# EAGLE design cdcio2 (EAGLE 6.6.0)
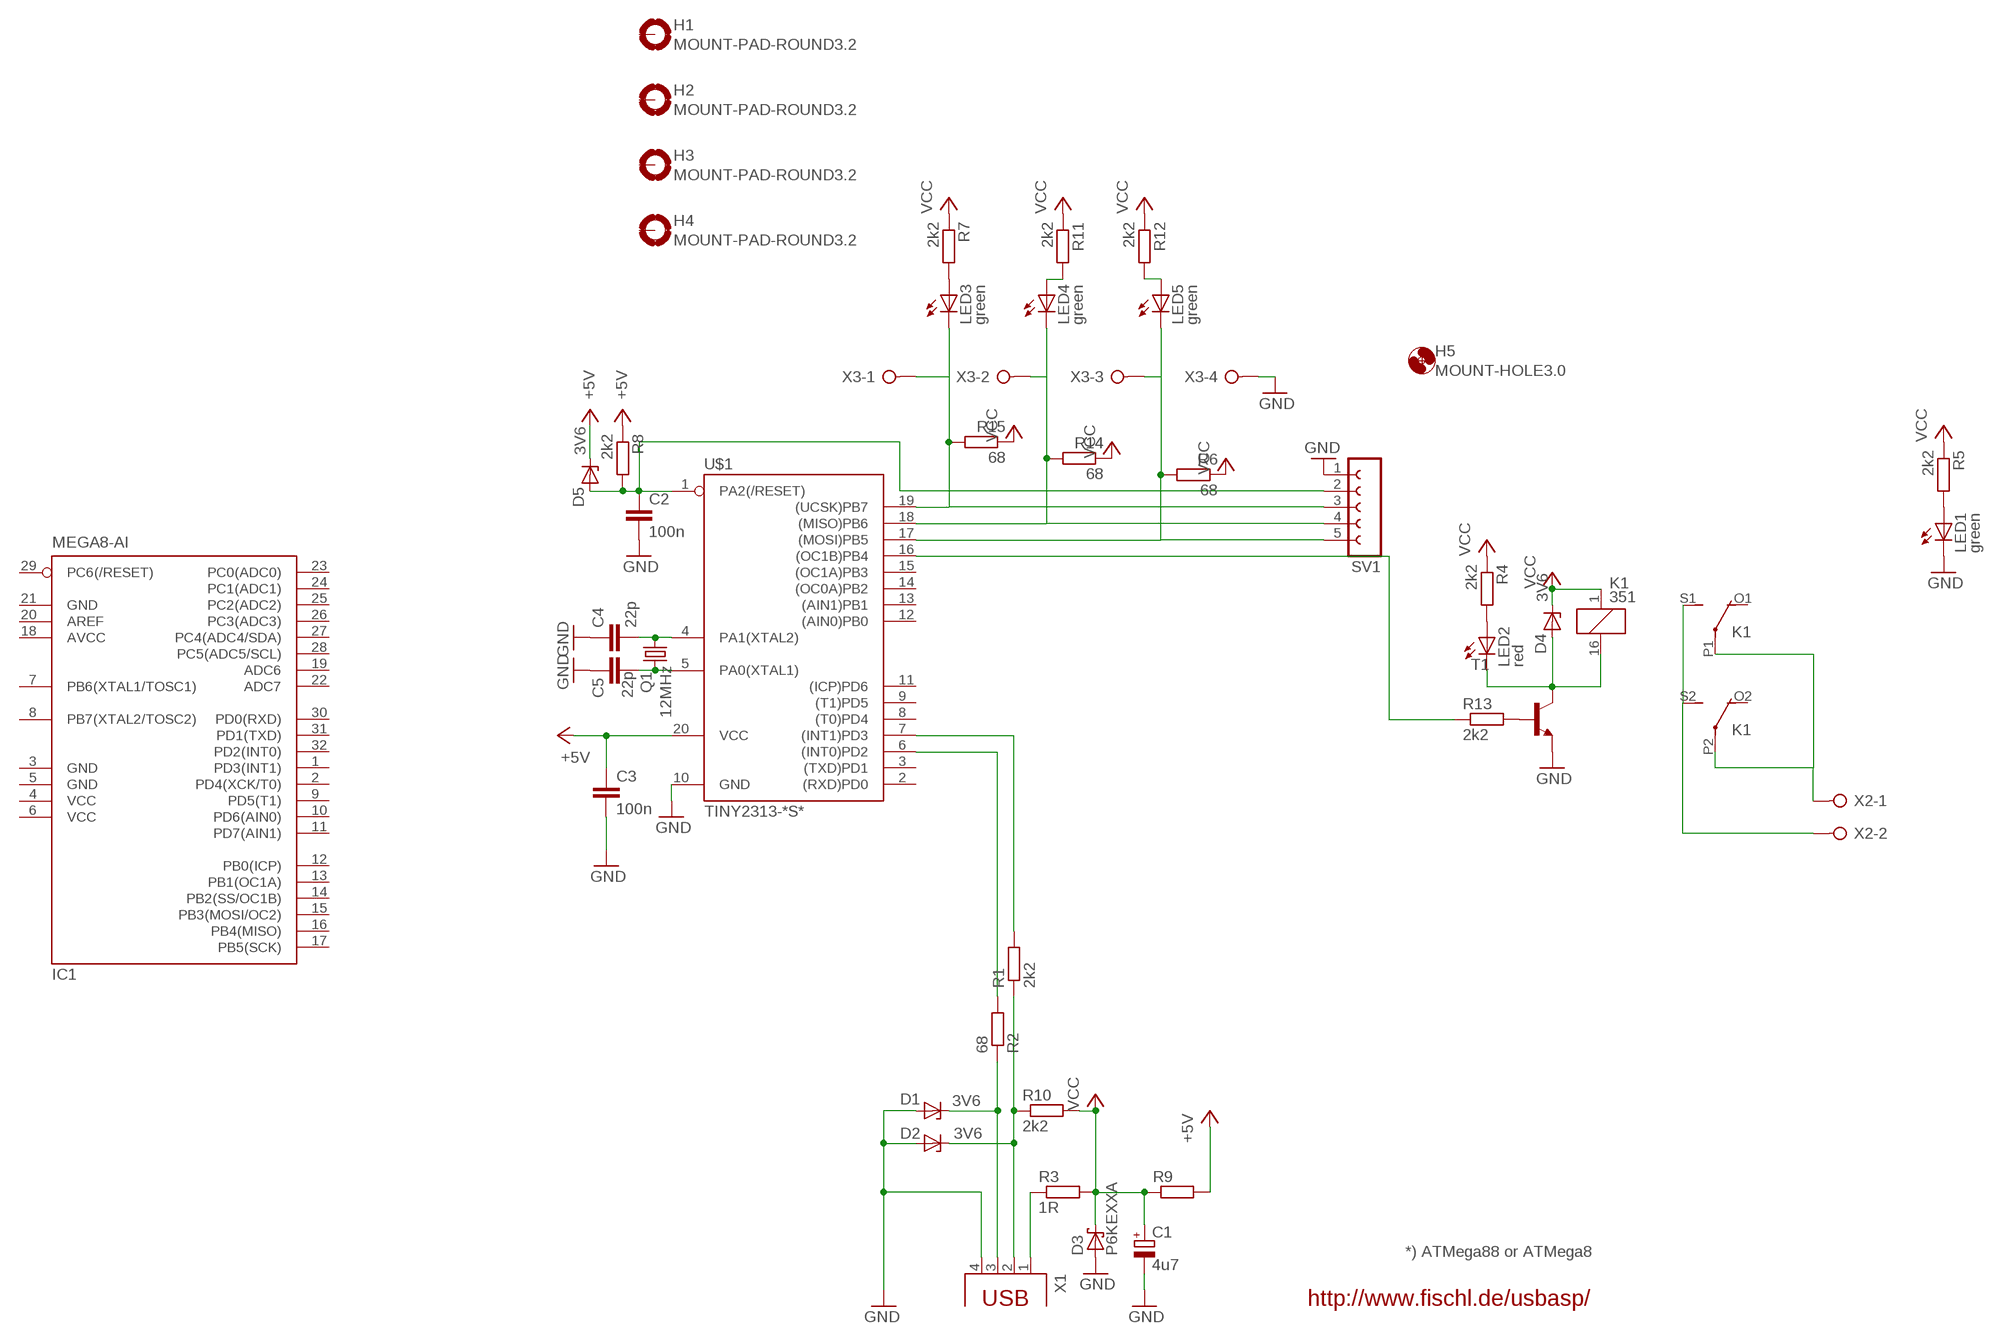
[diagram p0: schematic, sheet 1]

## Parts
C1  4u7  CPOL-EUE2.5-5  [E2,5-5]
C2  100n  C-EU025-024X044  [C025-024X044]
C3  100n  C-EU025-024X044  [C025-024X044]
C4  22p  C-EU025-024X044  [C025-024X044]
C5  22p  C-EU025-024X044  [C025-024X044]
D1  3V6  ZENER-DIODEDO34-7  [DO34Z7]
D2  3V6  ZENER-DIODEDO34-7  [DO34Z7]
D3  P6KEXXA  [C1702-15]
D4  3V6  ZENER-DIODEDO34-7  [DO34Z7]
D5  3V6  ZENER-DIODEDO34-7  [DO34Z7]
H1  MOUNT-PAD-ROUND3.2  [3,2-PAD]
H2  MOUNT-PAD-ROUND3.2  [3,2-PAD]
H3  MOUNT-PAD-ROUND3.2  [3,2-PAD]
H4  MOUNT-PAD-ROUND3.2  [3,2-PAD]
H5  MOUNT-HOLE3.0  [3,0]
IC1  MEGA8-AI  [TQFP32-08]
K1  351  [351]
LED1  green  LED3MM  [LED3MM]
LED2  red  LED3MM  [LED3MM]
LED3  green  LED3MM  [LED3MM]
LED4  green  LED3MM  [LED3MM]
LED5  green  LED3MM  [LED3MM]
Q1  12MHz  CRYTALHC49S  [HC49/S]
R1  2k2  R-EU_0207/2V  [0207/2V]
R2  68  R-EU_0207/10  [0207/10]
R3  1R  R-EU_0207/2V  [0207/2V]
R4  2k2  R-EU_0207/2V  [0207/2V]
R5  2k2  R-EU_0207/2V  [0207/2V]
R6  68  R-EU_0207/10  [0207/10]
R7  2k2  R-EU_0207/2V  [0207/2V]
R8  2k2  R-EU_0207/2V  [0207/2V]
R9  R-EU_0207/2V  [0207/2V]
R10  2k2  R-EU_0207/2V  [0207/2V]
R11  2k2  R-EU_0207/2V  [0207/2V]
R12  2k2  R-EU_0207/2V  [0207/2V]
R13  2k2  R-EU_0207/2V  [0207/2V]
R14  68  R-EU_0207/10  [0207/10]
R15  68  R-EU_0207/10  [0207/10]
SV1  FE05-1  [FE05-1]
T1  2N4124-NPN-TO92-CBE  [TO92-CBE]
U$1  TINY2313-*S*  [SO20L$]
X1  PN61729  [PN61729]
X2  W237-02P  [W237-132]
X3  W237-04P  [W237-4P]

## Nets
+5V: C3.1 D5.C R8.1 R9.2 U$1.20(VCC)
GND: C1.- C2.2 C3.2 C4.1 C5.1 D1.A D2.A D3.A LED1.K(C) SV1.1 T1.E U$1.10(GND) X1.4 X3.4
N$1: C2.1 D5.A R8.2 SV1.2 U$1.1(PA2(/RESET))
N$2: R13.2 T1.B
N$3: R13.1 U$1.16((OC1B)PB4)
N$4: D4.A K1.16 LED2.K(C) T1.C
N$5: D2.C R1.1 R10.1 X1.2
N$6: K1.S1(2:S) K1.S2(3:S) X2.2
N$7: R2.2 U$1.6((INT0)PD2)
N$8: D1.C R2.1 X1.3
N$9: LED2.A R4.2
N$10: K1.P1(2:P) K1.P2(3:P) X2.1
N$11: R3.1 X1.1
N$12: LED1.A R5.2
N$13: LED3.A R7.2
N$14: LED4.A R11.2
N$15: LED5.A R12.2
N$16: R1.2 U$1.7((INT1)PD3)
N$17: LED3.K(C) R15.2 SV1.3 U$1.19((UCSK)PB7) X3.1
N$18: LED4.K(C) R14.2 SV1.4 U$1.18((MISO)PB6) X3.2
N$19: LED5.K(C) R6.2 SV1.5 U$1.17((MOSI)PB5) X3.3
N$22: C4.2 Q1.2 U$1.4(PA1(XTAL2))
N$23: C5.2 Q1.1 U$1.5(PA0(XTAL1))
VCC: C1.+ D3.C D4.C K1.1 R3.2 R4.1 R5.1 R6.1 R7.1 R9.1 R10.2 R11.1 R12.1 R14.1 R15.1
Unconnected: H1.B3,2(MOUNT) H2.B3,2(MOUNT) H3.B3,2(MOUNT) H4.B3,2(MOUNT) IC1.1(PD3(INT1)) IC1.2(PD4(XCK/T0)) IC1.7(PB6(XTAL1/TOSC1)) IC1.8(PB7(XTAL2/TOSC2)) IC1.9(PD5(T1)) IC1.10(PD6(AIN0)) IC1.11(PD7(AIN1)) IC1.12(PB0(ICP)) IC1.13(PB1(OC1A)) IC1.14(PB2(SS/OC1B)) IC1.15(PB3(MOSI/OC2)) IC1.16(PB4(MISO)) IC1.17(PB5(SCK)) IC1.19(ADC6) IC1.20(AREF) IC1.22(ADC7) IC1.23(PC0(ADC0)) IC1.24(PC1(ADC1)) IC1.25(PC2(ADC2)) IC1.26(PC3(ADC3)) IC1.27(PC4(ADC4/SDA)) IC1.28(PC5(ADC5/SCL)) IC1.29(PC6(/RESET)) IC1.30(PD0(RXD)) IC1.31(PD1(TXD)) IC1.32(PD2(INT0)) K1.O1(2:O) K1.O2(3:O) U$1.2((RXD)PD0) U$1.3((TXD)PD1) U$1.8((T0)PD4) U$1.9((T1)PD5) U$1.11((ICP)PD6) U$1.12((AIN0)PB0) U$1.13((AIN1)PB1) U$1.14((OC0A)PB2) U$1.15((OC1A)PB3)

## Notes on the sheet
- *) ATMega88 or ATMega8
- http://www.fischl.de/usbasp/

## Power pins joined to a net without a drawn wire
AVCC: IC1.18(AVCC)
GND: IC1.3(GND) IC1.5(GND) IC1.21(GND)
VCC: IC1.4(VCC) IC1.6(VCC)

## Library data of the parts
C1 = rcl:CPOL-EU: POLARIZED CAPACITOR, European symbol
C2-C5 = rcl:C-EU: CAPACITOR, European symbol
D1 D2 D4 D5 = diode:ZENER-DIODE: Z-Diode
D3 = diode:P6KEXXA: DIODE transient-voltage suppressor
H1-H4 = holes:MOUNT-PAD-ROUND: MOUNTING PAD, round
H5 = holes:MOUNT-HOLE: MOUNTING HOLE with drill center marker
IC1 = atmel:MEGA8: MICROCONTROLLER 8 Kbytes FLASH, 1 kbytes SRAM, 512 bytes EEPROM, USART, 6-channel 10 bit ADC, 2-channel 8 bit ADC Pin compatible with Atmega48, ATMega88, ATMega168 Source: avr.lbr; MPN: ATMEGA8-16AU; OC_FARNELL: 9171371; OC_NEWARK: 73M8863
K1 = relay:351: RELAY 2 x switch, Omron; OC_FARNELL: unknown; OC_NEWARK: unknown
LED1-LED5 = led:LED: LED OSRAM: - CHIPLED LG R971, LG N971, LY N971, LG Q971, LY Q971, LO R971, LY R971 LH N974, LH R974 LS Q976, LO Q976, LY Q976 LO Q996 - Hyper CHIPLED LW Q18S LB Q993, LB Q99A, LB R99A - SideLED LS A670, LO A670, LY A670, LG A670, LP A670 LB A673, LV A673, LT A673, LW A673 LH A674 LY A675 LS A676, LA A676, LO A676, LY A676, LW A676 LS A679, LY A679, LG A679 - Hyper Micro SIDELED® LS Y876, LA Y876, LO Y876, LY Y876 LT Y87S - SmartLED LW L88C, LW L88S LB L89C, LB L89S, LG L890 LS L89K, LO L89K, LY L89K LS L896, LA L896, LO L896, LY L896 - TOPLED LS T670, LO T670, LY T670, LG T670, LP T670 LSG T670, LSP T670, LSY T670, LOP T670, LYG T670 LG T671, LOG T671, LSG T671 LB T673, LV T673, LT T673, LW T673 LH T674 LS T676, LA T676, LO T676, LY T676, LB T676, LH T676, LSB T676, LW T676 LB T67C, LV T67C, LT T67C, LS T67K, LO T67K, LY T67K, LW E67C LS E67B, LA E67B, LO E67B, LY E67B, LB E67C, LV E67C, LT E67C LW T67C LS T679, LY T679, LG T679 LS T770, LO T770, LY T770, LG T770, LP T770 LB T773, LV T773, LT T773, LW T773 LH T774 LS E675, LA E675, LY E675, LS T675 LS T776, LA T776, LO T776, LY T776, LB T776 LHGB T686 LT T68C, LB T68C - Hyper Mini TOPLED® LB M676 - Mini TOPLED Santana® LG M470 LS M47K, LO M47K, LY M47K Source: http://www.osram.convergy.de/
Q1 = crystal:CRYTAL: CRYSTAL
R1-R15 = rcl:R-EU_: RESISTOR, European symbol
SV1 = con-lsta:FE05-1: FEMALE HEADER; OC_FARNELL: unknown; OC_NEWARK: unknown
T1 = transistor:*-NPN-: NPN Transistror BF959 corrected 2008.03.06
U$1 = avr-7:TINY2313*: Atmel Tiny2313 2K Flash, 128 bytes EEPROM, 128 bytes RAM
X1 = con-berg:PN61729: BERG USB connector
X2 = con-wago-508:W237-02P: WAGO SREW CLAMP; OC_FARNELL: unknown; OC_NEWARK: unknown
X3 = con-wago-508:W237-04P: WAGO SREW CLAMP; OC_FARNELL: unknown; OC_NEWARK: unknown

## Board
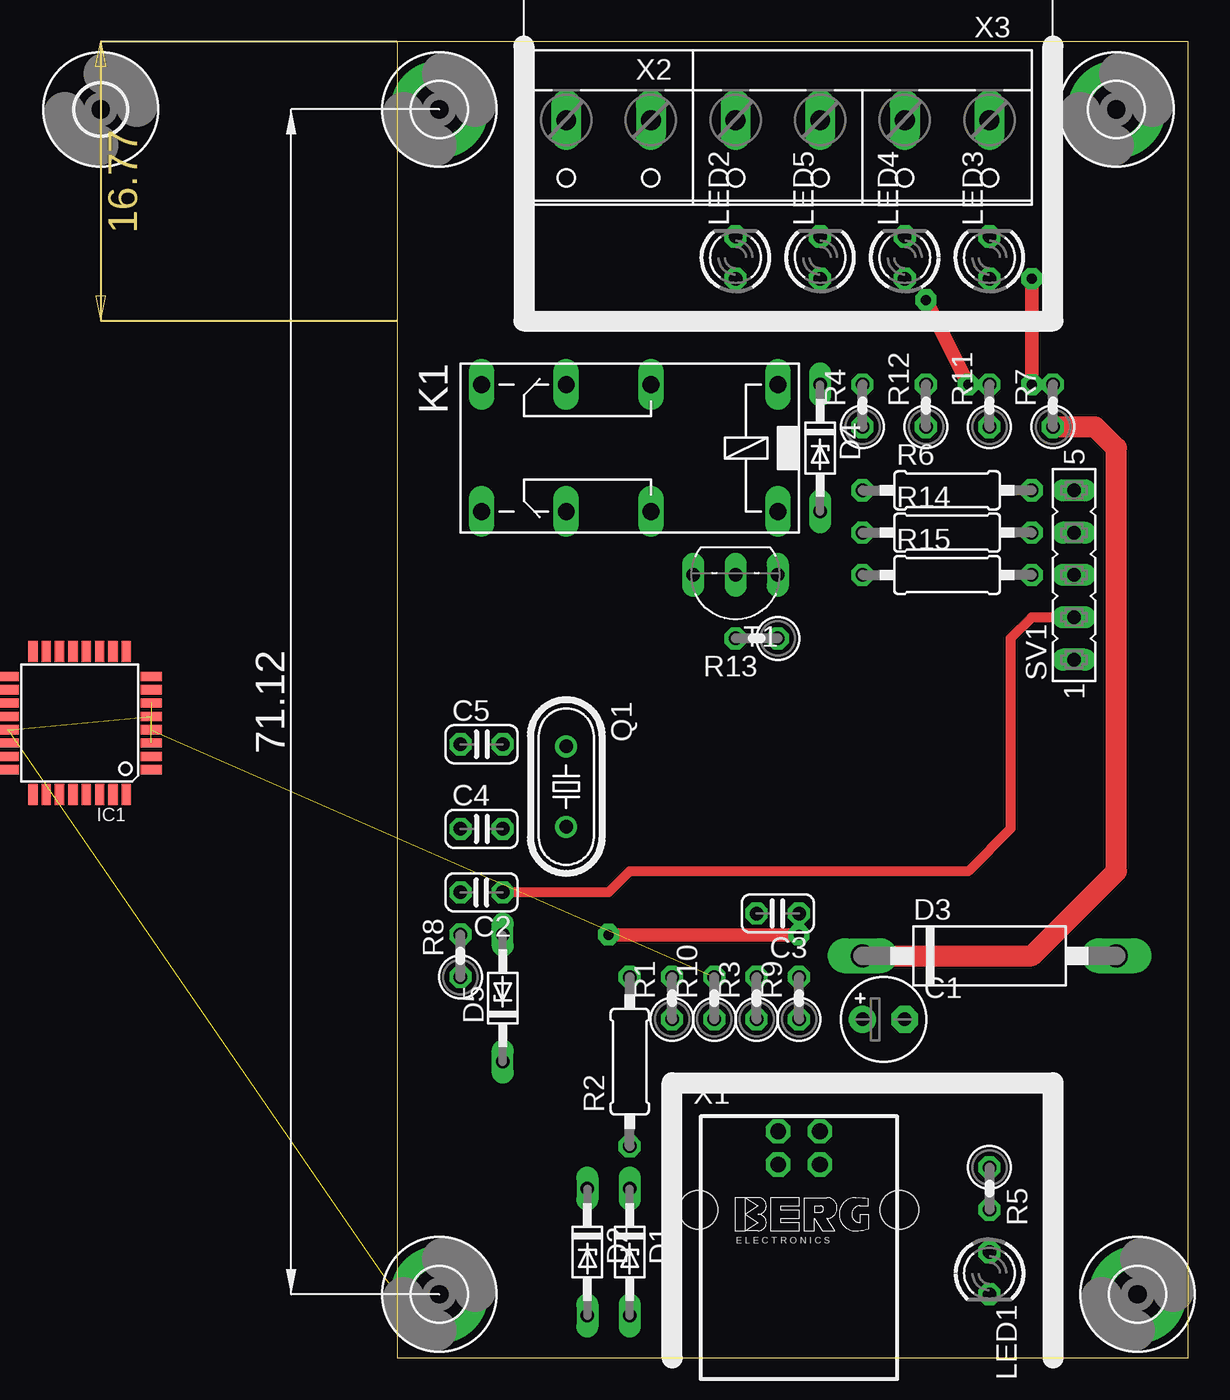
[diagram p1: board, top side]
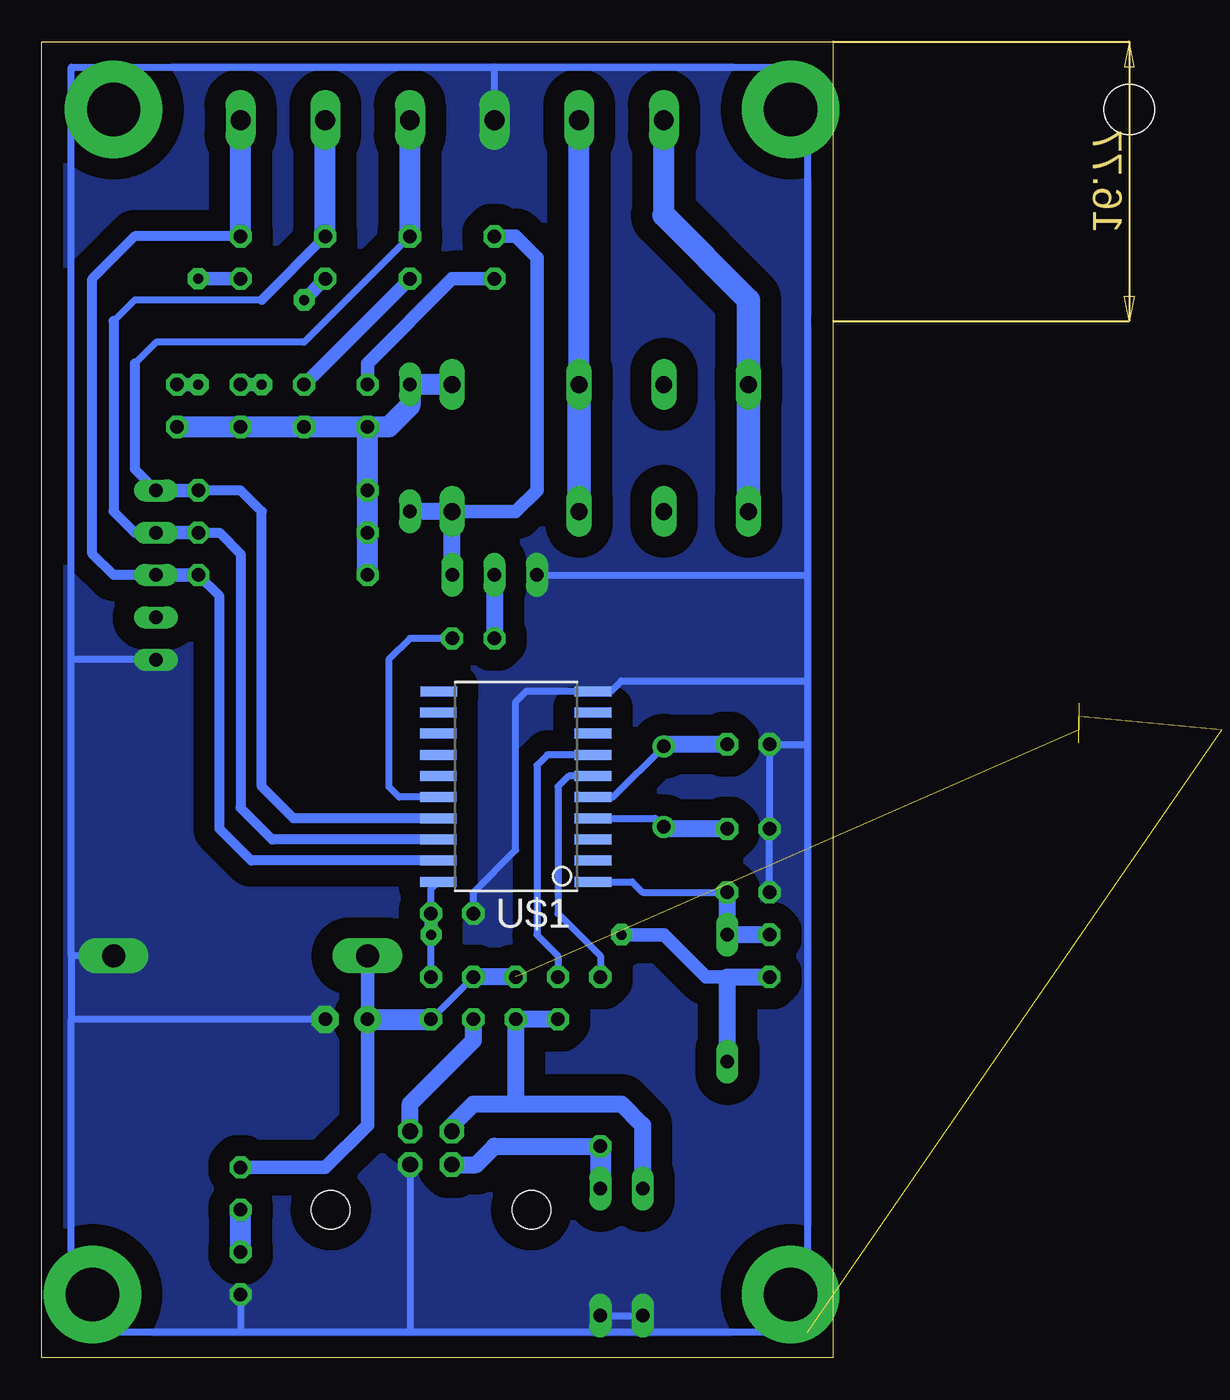
[diagram p2: board, bottom side, seen from below]

Size 47.5 x 79 mm. Coordinates in mm from the lower left corner, seen from the top.
Outline: 0,0 47.5,0 47.5,79 0,79 0,0
Copper layers (1*16): Top 0.035mm / dielectric 1.5mm / Bottom 0.035mm
Design rules "default": minimum track width 10mil, minimum drill 24mil, track to track 8mil, track to pad 8mil, pad to pad 8mil, via to via 8mil, smd to smd 8mil, copper to edge 40mil, drill to drill 8mil, minimum pad ring 10mil, minimum via ring 8mil, stop-mask expansion 4mil, vias tented up to drill 0mil, thermal gap 10mil

### Footprints (pad centres in the part's own frame; a part is rotated, then mirrored left to right if it is on the bottom)
E2,5-5 = drill 0.813 pad 1.6: + -1.27,0 | drill 0.813 pad 1.6 octagon: - 1.27,0
C025-024X044 = drill 0.813 octagon: 1 -1.27,0; 2 1.27,0
DO34Z7 = drill 0.813 long: A 3.81,0; C -3.81,0
C1702-15 = drill 1.397 long: A 7.62,0; C -7.62,0
3,2-PAD = drill 3.2 pad 5.842: B3,2 0,0
3,0 = hole 3: 0,0
TQFP32-08 = smd 1.27 x 0.559: 1 -4.293,2.8; 2 -4.293,2; 3 -4.293,1.2; 4 -4.293,0.4; 5 -4.293,-0.4; 6 -4.293,-1.2; 7 -4.293,-2; 8 -4.293,-2.8; 17 4.293,-2.8; 18 4.293,-2; 19 4.293,-1.2; 20 4.293,-0.4; 21 4.293,0.4; 22 4.293,1.2; 23 4.293,2; 24 4.293,2.8 | smd 0.559 x 1.27: 9 -2.8,-4.293; 10 -2,-4.293; 11 -1.2,-4.293; 12 -0.4,-4.293; 13 0.4,-4.293; 14 1.2,-4.293; 15 2,-4.293; 16 2.8,-4.293; 25 2.8,4.293; 26 2,4.293; 27 1.2,4.293; 28 0.4,4.293; 29 -0.4,4.293; 30 -1.2,4.293; 31 -2,4.293; 32 -2.8,4.293
351 = drill 1.016 long: 1 -3.81,-3.81; 16 -3.81,3.81; O1 8.89,-3.81; O2 8.89,3.81; P1 3.81,-3.81; P2 3.81,3.81; S1 13.97,-3.81; S2 13.97,3.81
LED3MM = drill 0.813 octagon: A -1.27,0; K 1.27,0
HC49/S = drill 0.813: 1 -2.413,0; 2 2.413,0
0207/2V = drill 0.813 octagon: 1 -1.27,0; 2 1.27,0
0207/10 = drill 0.813 octagon: 1 -5.08,0; 2 5.08,0
FE05-1 = drill 0.813 long: 1 -5.08,0; 2 -2.54,0; 3 0,0; 4 2.54,0; 5 5.08,0
TO92-CBE = drill 0.813 long: B 0,0; C -2.54,0; E 2.54,0
SO20L$ = smd 0.61 x 2.21: 1 -5.715,-4.636; 2 -4.445,-4.636; 3 -3.175,-4.636; 4 -1.905,-4.636; 5 -0.635,-4.636; 6 0.635,-4.636; 7 1.905,-4.636; 8 3.175,-4.636; 9 4.445,-4.636; 10 5.715,-4.636; 11 5.715,4.61; 12 4.445,4.636; 13 3.175,4.636; 14 1.905,4.636; 15 0.635,4.636; 16 -0.635,4.636; 17 -1.905,4.636; 18 -3.175,4.636; 19 -4.445,4.636; 20 -5.715,4.636
PN61729 = drill 0.95 octagon: 1 1.25,4.71; 2 -1.25,4.71; 3 -1.25,2.71; 4 1.25,2.71 | hole 2.3: -6.02,0; 6.02,0
W237-132 = drill 1.194 long: 1 -2.54,-0.635; 2 2.54,-0.635
W237-4P = drill 1.194 long: 1 -7.62,-0.635; 2 -2.54,-0.635; 3 2.54,-0.635; 4 7.62,-0.635

### Placement (x,y rotation side)
C1  29.21,20.32 0 top
C2  5.08,27.94 180 top
C3  22.86,26.67 180 top
C4  5.08,31.75 0 top
C5  5.08,36.83 0 top
D1  13.97,6.35 270 top
D2  11.43,6.35 270 top
D3  35.56,24.13 0 top
D4  25.4,54.61 270 top
D5  6.35,21.59 90 top
H1  2.54,3.81 0 top
H2  44.45,3.81 0 top
H3  2.54,74.93 0 top
H4  43.18,74.93 0 top
H5  -17.78,74.93 0 top  (outside the outline)
IC1  -19.05,38.1 180 top  (outside the outline)
K1  19.05,54.61 180 top
LED1  35.56,5.08 270 top
LED2  20.32,66.04 90 top
LED3  35.56,66.04 90 top
LED4  30.48,66.04 90 top
LED5  25.4,66.04 90 top
Q1  10.16,34.29 270 top
R1  16.51,21.59 90 top
R2  13.97,17.78 90 top
R3  21.59,21.59 90 top
R4  27.94,57.15 90 top
R5  35.56,10.16 270 top
R6  33.02,52.07 0 top
R7  39.37,57.15 90 top
R8  3.81,24.13 90 top
R9  24.13,21.59 90 top
R10  19.05,21.59 90 top
R11  35.56,57.15 90 top
R12  31.75,57.15 90 top
R13  21.59,43.18 180 top
R14  33.02,49.53 0 top
R15  33.02,46.99 0 top
SV1  40.64,46.99 90 top
T1  20.32,46.99 180 top
U$1  19.05,34.29 90 bottom
X1  24.13,8.89 0 top
X2  12.7,73.66 180 top
X3  27.94,73.66 180 top

### Tracks (layer width: path | path; a pad name or v marks a point on that pad's centre or on a via)
+5V  (via drill 0.6 pad 1.27)
  Top 0.813: v24.13,25.4 v12.7,25.4
  Bottom 0.406: C3.1 24.13,28.13 U$1.20 | R9.2 v24.13,25.4
  Bottom 0.813: C3.1 v24.13,25.4 | v12.7,25.4 10.16,25.4 7.62,22.86 6.35,22.86
  Bottom 1.016: D5.C 6.35,22.86 R8.1
GND  (3 unrouted)
  Bottom 0.406: C3.2 21.59,27.94 19.05,30.48 19.05,39.37 18.41,40.01 U$1.10 13.34,40.01 12.7,40.64 1.54,40.64 | 45.72,20.32 45.72,1.54 35.56,1.54 | 45.72,24.13 45.72,41.91 | 45.72,41.91 45.72,77.47 20.32,77.47 | 20.32,77.47 1.54,77.47 1.54,46.99 | 1.54,46.99 1.54,40.64 | 1.54,40.64 1.54,36.83 | 1.54,36.83 1.54,1.54 11.43,1.54 | 11.43,1.54 25.4,1.54 | 25.4,1.54 35.56,1.54 | T1.E 1.54,46.99 | 1.54,36.83 C5.1 C4.1 C2.2 | D1.A D2.A 11.43,1.54 | X1.4 25.38,1.56 25.4,1.54 | LED1.K 35.56,1.54 | X3.4 20.32,77.47 | C1.- 45.72,20.32 | D3.A 45.72,24.13 | 45.72,24.13 45.72,20.32 | SV1.1 45.72,41.91
  pour Bottom (isolate 1.27, no thermals): -7.62,0 -7.62,-2.54 52.07,-2.54 52.07,80.01 -2.54,80.01 -2.54,24.13 -7.62,19.05
N$1
  Top 0.61: SV1.2 38.1,44.45 36.83,43.18 36.83,31.75 34.29,29.21 13.97,29.21 12.7,27.94 C2.1
  Bottom 0.406: U$1.1 12.06,28.57 11.43,27.94 C2.1
  Bottom 1.016: R8.2 D5.A C2.1
N$2
  Bottom 1.016: T1.B R13.2
N$3
  Bottom 0.406: R13.1 25.4,43.18 26.67,41.91 26.67,34.29 26.04,33.66 U$1.16
N$4
  Bottom 0.813: LED2.K 19.05,67.31 17.78,66.04 17.78,52.07 19.05,50.8 K1.16
  Bottom 1.016: T1.C K1.16 D4.A
N$5
  Bottom 1.016: X1.2 22.88,13.95 21.59,15.24 19.05,15.24 | 19.05,15.24 12.7,15.24 11.43,13.97 D2.C | R1.1 R10.1 19.05,15.24
N$6
  Bottom 1.27: 10.16,68.58 X2.2
  Bottom 1.422: K1.S2 K1.S1 5.08,63.5 10.16,68.58
N$7
  Bottom 0.406: U$1.6 15.88,34.92 16.51,34.29 16.51,26.67 13.97,24.13 R2.2
N$8
  Bottom 1.016: X1.3 21.42,11.6 20.32,12.7 R2.1
  Bottom 1.27: R2.1 D1.C
N$9
  Bottom 0.813: LED2.A 22.86,64.77 27.94,59.69 R4.2
N$10
  Bottom 1.27: K1.P1 X2.1 15.24,74.93
  Bottom 1.422: K1.P1 K1.P2
N$11
  Bottom 1.016: X1.1 25.38,15.26 21.59,19.05 R3.1
N$12
  Bottom 1.27: LED1.A R5.2
N$13  (via drill 0.6 pad 1.27)
  Top 0.813: v38.1,64.77 v38.1,58.42
  Bottom 0.813: LED3.A v38.1,64.77 | v38.1,58.42 R7.2
N$14  (via drill 0.6 pad 1.27)
  Top 0.813: v31.75,63.5 v34.29,58.42
  Bottom 0.813: LED4.A v31.75,63.5 | v34.29,58.42 R11.2
N$15
  Bottom 0.813: LED5.A R12.2
N$16
  Bottom 0.406: U$1.7 17.14,36.2 17.78,35.56 17.78,25.4 16.51,24.13 R1.2
N$17
  Bottom 0.61: LED3.K 41.91,67.31 44.45,64.77 44.45,48.26 43.18,46.99 SV1.3 | U$1.19 34.92,29.84 36.83,31.75 36.83,45.72 R15.2
  Bottom 0.813: R15.2 SV1.3
  Bottom 1.27: LED3.K X3.1
N$18
  Bottom 0.406: 34.29,63.5 41.91,63.5 43.18,62.23
  Bottom 0.61: LED4.K 34.29,63.5 | 43.18,62.23 43.18,50.8 41.91,49.53 SV1.4 | R14.2 36.83,49.53 35.56,48.26 35.56,33.02 33.66,31.11 U$1.18
  Bottom 0.813: SV1.4 R14.2
  Bottom 1.27: LED4.K X3.2
N$19
  Bottom 0.406: LED5.K 31.75,60.96 40.64,60.96 41.91,59.69
  Bottom 0.61: 41.91,59.69 41.91,53.34 SV1.5 | U$1.17 32.38,32.38 34.29,34.29 34.29,50.8 35.56,52.07 R6.2
  Bottom 0.813: R6.2 SV1.5
  Bottom 1.27: LED5.K X3.3
N$22
  Bottom 0.406: U$1.4 10.67,32.38 Q1.2
  Bottom 1.016: C4.2 10.03,31.75 Q1.2
N$23
  Bottom 0.406: U$1.5 13.21,33.66 Q1.1
  Bottom 1.016: C5.2 10.03,36.83 Q1.1
VCC  (2 unrouted)
  Top 1.27: D3.C 38.1,24.13 43.18,29.21 43.18,54.61 41.91,55.88 R7.1
  Bottom 0.406: R9.1 R3.2
  Bottom 0.813: D3.C C1.+ 27.94,13.97 30.48,11.43 R5.1
  Bottom 1.016: R10.2 R3.2
  Bottom 1.27: C1.+ R9.1 | R15.1 R14.1 R6.1 R4.1 | K1.1 D4.C 25.4,57.15 26.67,55.88 R4.1 | R4.1 R12.1 R11.1 R7.1